# EAGLE design T STorM32 motor v25E (EAGLE 7.5.0)
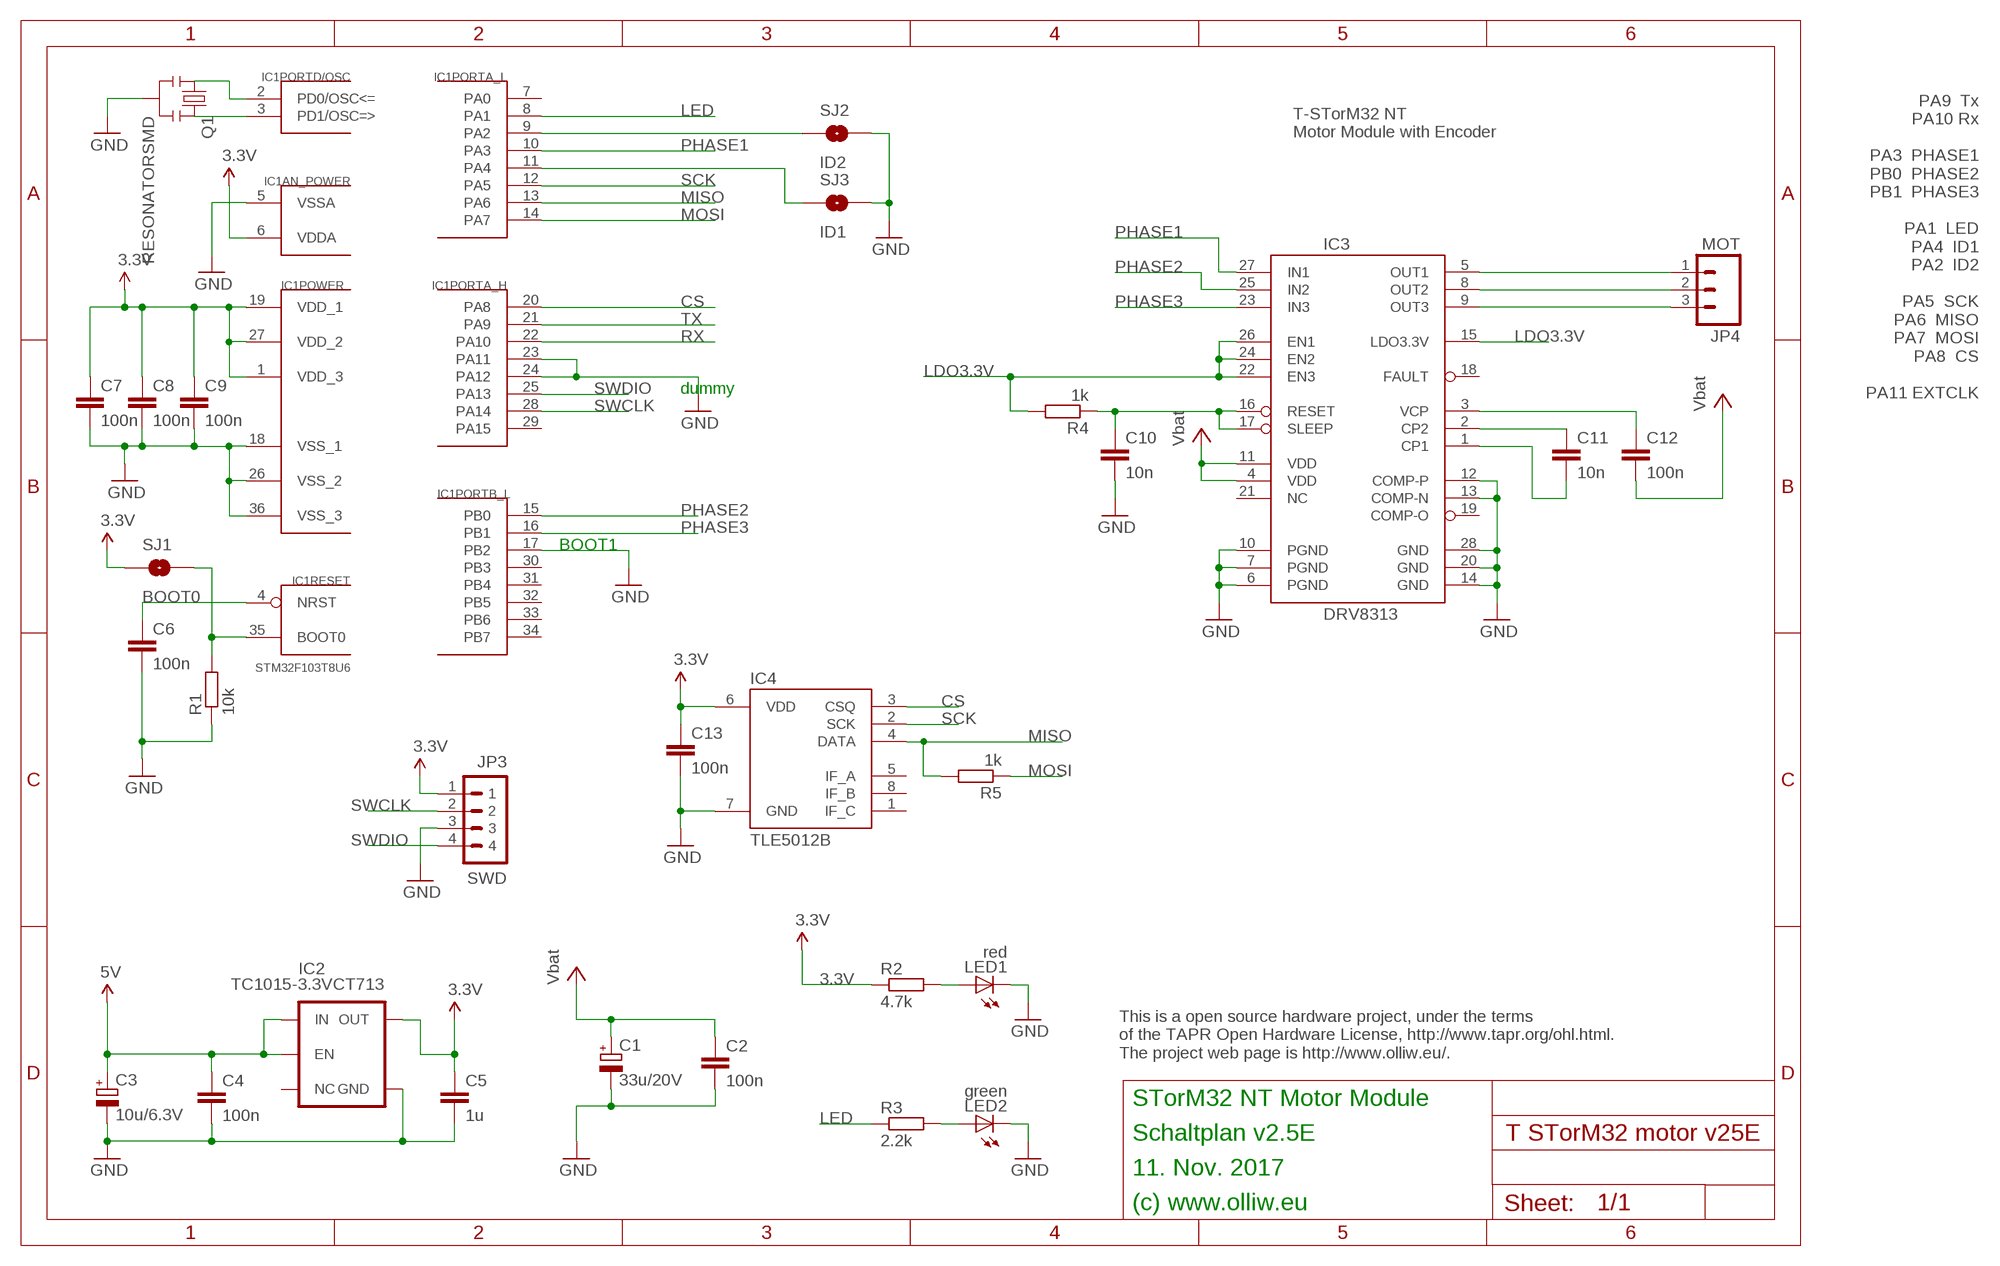
[diagram p0: schematic, sheet 1]

## Parts
C1  33u/20V  CPOL-EUSMCC  [SMC_C]
C2  100n  C-EUC0603  [C0603]
C3  10u/6.3V  CPOL-EUSMCB  [SMC_B]
C4  100n  C-EUC0603  [C0603]
C5  1u  C-EUC0603  [C0603]
C6  100n  C-EUC0603  [C0603]
C7  100n  C-EUC0603  [C0603]
C8  100n  C-EUC0603  [C0603]
C9  100n  C-EUC0603  [C0603]
C10  10n  C-EUC0603  [C0603]
C11  10n  C-EUC0603  [C0603]
C12  100n  C-EUC0603  [C0603]
C13  100n  C-EUC0603  [C0603]
IC1  STM32F103T8U6  STM32F10XTXU6  [VFQFPN36]
IC2  TC1015-3.3VCT713  V_REG_TPS76433SOT23-5  [SOT23-5]
IC3  DRV8313  [HTSSOP28]
IC4  TLE5012B  [SO08]
JP3  SWD  P4X1_1P27-OCT_BILEX  [4X1_1P27_OCT_BILEX]
JP4  MOT  M031X03_NO_SILK  [1X03_NO_SILK]
LED1  red  LEDCHIPLED_0603  [CHIPLED_0603]
LED2  green  LEDCHIPLED_0603  [CHIPLED_0603]
Q1  RESONATORSMD  [RESONATOR-SMD]
R1  10k  R-EU_R0603  [R0603]
R2  4.7k  R-EU_R0603  [R0603]
R3  2.2k  R-EU_R0603  [R0603]
R4  1k  R-EU_R0603  [R0603]
R5  1k  R-EU_R0603  [R0603]
SJ1  BOOT0  SOLDERJUMPERNO  [SJ_2S-NO]
SJ2  ID2  SOLDERJUMPERNO  [SJ_2S-NO]
SJ3  ID1  SOLDERJUMPERNO  [SJ_2S-NO]

## Nets
3.3V: C5.1 C7.1 C8.1 C9.1 C13.1 IC1.1(POWER:VDD_3) IC1.6(AN_POWER:VDDA) IC1.19(POWER:VDD_1) IC1.27(POWER:VDD_2) IC2.5(OUT) IC4.6(VDD) JP3.1 R2.1 SJ1.1
5V: C3.+ C4.1 IC2.1(IN) IC2.3(EN)
CS: IC1.20(PORTA_H:PA8) IC4.3(CSQ)
GND: C1.- C2.2 C3.- C4.2 C5.2 C6.2 C7.2 C8.2 C9.2 C10.2 C13.2 IC1.5(AN_POWER:VSSA) IC1.17(PORTB_L:PB2) IC1.18(POWER:VSS_1) IC1.23(PORTA_H:PA11) IC1.24(PORTA_H:PA12) IC1.26(POWER:VSS_2) IC1.36(POWER:VSS_3) IC2.2(GND) IC3.6(PGND) IC3.7(PGND) IC3.10(PGND) IC3.12(COMP-P) IC3.13(COMP-N) IC3.14(GND) IC3.20(GND) IC3.28(GND) IC4.7(GND) JP3.3 LED1.C LED2.C Q1.2 R1.1 SJ2.2 SJ3.2
LDO3.3V: IC3.15(LDO3.3V) IC3.22(EN3) IC3.24(EN2) IC3.26(EN1) R4.2
LED: IC1.8(PORTA_L:PA1) R3.1
M1: IC3.5(OUT1) JP4.1
M2: IC3.8(OUT2) JP4.2
M3: IC3.9(OUT3) JP4.3
MISO: IC1.13(PORTA_L:PA6) IC4.4(DATA) R5.2
MOSI: IC1.14(PORTA_L:PA7) R5.1
N$3: IC1.9(PORTA_L:PA2) SJ2.1
N$4: IC1.11(PORTA_L:PA4) SJ3.1
N$7: C6.1 IC1.4(RESET:NRST)
N$8: IC1.35(RESET:BOOT0) R1.2 SJ1.2
N$9: IC1.2(PORTD/OSC:PD0/OSC<=) Q1.1
N$10: IC1.3(PORTD/OSC:PD1/OSC=>) Q1.3
N$11: LED1.A R2.2
N$12: LED2.A R3.2
N$16: C11.1 IC3.2(CP2)
N$18: C11.2 IC3.1(CP1)
N$19: C10.1 IC3.16(RESET) IC3.17(SLEEP) R4.1
N$20: C12.1 IC3.3(VCP)
PHASE1: IC1.10(PORTA_L:PA3) IC3.27(IN1)
PHASE2: IC1.15(PORTB_L:PB0) IC3.25(IN2)
PHASE3: IC1.16(PORTB_L:PB1) IC3.23(IN3)
RX: IC1.22(PORTA_H:PA10)
SCK: IC1.12(PORTA_L:PA5) IC4.2(SCK)
SWCLK: IC1.28(PORTA_H:PA14) JP3.2
SWDIO: IC1.25(PORTA_H:PA13) JP3.4
TX: IC1.21(PORTA_H:PA9)
VBAT: C1.+ C2.1 C12.2 IC3.4(VDD) IC3.11(VDD) ; supply symbol labelled Vbat
Unconnected: IC1.7(PORTA_L:PA0) IC1.29(PORTA_H:PA15) IC1.30(PORTB_L:PB3) IC1.31(PORTB_L:PB4) IC1.32(PORTB_L:PB5) IC1.33(PORTB_L:PB6) IC1.34(PORTB_L:PB7) IC2.4(NC) IC3.18(FAULT) IC3.19(COMP-O) IC3.21(NC) IC4.1(IF_C) IC4.5(IF_A) IC4.8(IF_B)

## Notes on the sheet
- PA9  Tx
  PA10 Rx
  
  PA3  PHASE1
  PB0  PHASE2
  PB1  PHASE3
  
  PA1  LED
  PA4  ID1
  PA2  ID2
  
  PA5  SCK
  PA6  MISO
  PA7  MOSI
  PA8  CS
  
  PA11 EXTCLK
- T-STorM32 NT
  Motor Module with Encoder
- dummy
- BOOT1
- This is a open source hardware project, under the terms
  of the TAPR Open Hardware License, http://www.tapr.org/ohl.html.
  The project web page is http://www.olliw.eu/.
- STorM32 NT Motor Module
- Schaltplan v2.5E
- 11. Nov. 2017
- (c) www.olliw.eu

## Library data of the parts
C1 C3 = rcl:CPOL-EU: POLARIZED CAPACITOR, European symbol
C2 C4-C13 = rcl:C-EU: CAPACITOR, European symbol
IC1 = # stm32:STM32F10XTXU6: STM32F101/103 36pad VFQPFN36
IC2 = # SparkFun2:V_REG_TPS76433: Voltage Regulator Older TI part. LDO 150mA regulator. No output by-pass cap option. See V_REG_LDO for a better part.
IC3 = # stdlib:DRV8313
IC4 = # stdlib:TLE5012B
JP3 = # stdlib:P4X1_1P27
JP4 = # SparkFun2:M03: Header 3 Standard 3-pin 0.1" header. Use with straight break away headers (SKU : PRT-00116), right angle break away headers (PRT-00553), swiss pins (PRT-00743), machine pins (PRT-00117), and female headers (PRT-00115). Molex polarized connector foot print use with SKU : PRT-08232 with associated crimp pins and housings.
LED1 LED2 = led:LED: LED OSRAM: - CHIPLED LG R971, LG N971, LY N971, LG Q971, LY Q971, LO R971, LY R971 LH N974, LH R974 LS Q976, LO Q976, LY Q976 LO Q996 - Hyper CHIPLED LW Q18S LB Q993, LB Q99A, LB R99A - SideLED LS A670, LO A670, LY A670, LG A670, LP A670 LB A673, LV A673, LT A673, LW A673 LH A674 LY A675 LS A676, LA A676, LO A676, LY A676, LW A676 LS A679, LY A679, LG A679 - Hyper Micro SIDELED® LS Y876, LA Y876, LO Y876, LY Y876 LT Y87S - SmartLED LW L88C, LW L88S LB L89C, LB L89S, LG L890 LS L89K, LO L89K, LY L89K LS L896, LA L896, LO L896, LY L896 - TOPLED LS T670, LO T670, LY T670, LG T670, LP T670 LSG T670, LSP T670, LSY T670, LOP T670, LYG T670 LG T671, LOG T671, LSG T671 LB T673, LV T673, LT T673, LW T673 LH T674 LS T676, LA T676, LO T676, LY T676, LB T676, LH T676, LSB T676, LW T676 LB T67C, LV T67C, LT T67C, LS T67K, LO T67K, LY T67K, LW E67C LS E67B, LA E67B, LO E67B, LY E67B, LB E67C, LV E67C, LT E67C LW T67C LS T679, LY T679, LG T679 LS T770, LO T770, LY T770, LG T770, LP T770 LB T773, LV T773, LT T773, LW T773 LH T774 LS E675, LA E675, LY E675, LS T675 LS T776, LA T776, LO T776, LY T776, LB T776 LHGB T686 LT T68C, LB T68C - Hyper Mini TOPLED® LB M676 - Mini TOPLED Santana® LG M470 LS M47K, LO M47K, LY M47K Source: http://www.osram.convergy.de LUXEON: - LUMILED® LXK2-PW12-R00, LXK2-PW12-S00, LXK2-PW14-U00, LXK2-PW14-V00 LXK2-PM12-R00, LXK2-PM12-S00, LXK2-PM14-U00 LXK2-PE12-Q00, LXK2-PE12-R00, LXK2-PE12-S00, LXK2-PE14-T00, LXK2-PE14-U00 LXK2-PB12-K00, LXK2-PB12-L00, LXK2-PB12-M00, LXK2-PB14-N00, LXK2-PB14-P00, LXK2-PB14-Q00 LXK2-PR12-L00, LXK2-PR12-M00, LXK2-PR14-Q00, LXK2-PR14-R00 LXK2-PD12-Q00, LXK2-PD12-R00, LXK2-PD12-S00 LXK2-PH12-R00, LXK2-PH12-S00 LXK2-PL12-P00, LXK2-PL12-Q00, LXK2-PL12-R00 Source: www.luxeon.com KINGBRIGHT: KA-3528ASYC Source: www.kingbright.com
Q1 = # SparkFun2:RESONATOR: Resonator Small SMD resonator. This is the itty bitty 10/20MHz resonators with built in caps. CSTCE10M0G55 and CSTCE20M0V53. Footprint has been reviewed closely but hasn't been tested yet.
R1-R5 = rcl:R-EU_: RESISTOR, European symbol
SJ1-SJ3 = # SparkFun2:SOLDERJUMPER: Solder Jumper Standard SMD solder jumper. Used to automate production. Two varients : Normally Open and Normally Closed are the same, but have different paste layers. NC will have a large amount of paste and should jumper during reflow.

## Board
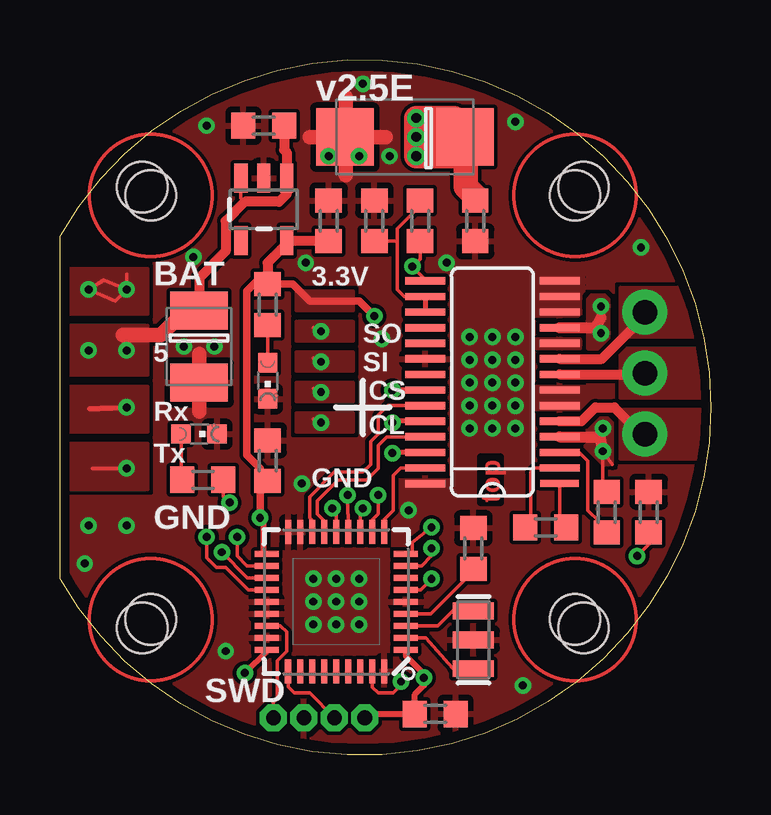
[diagram p1: board, top side]
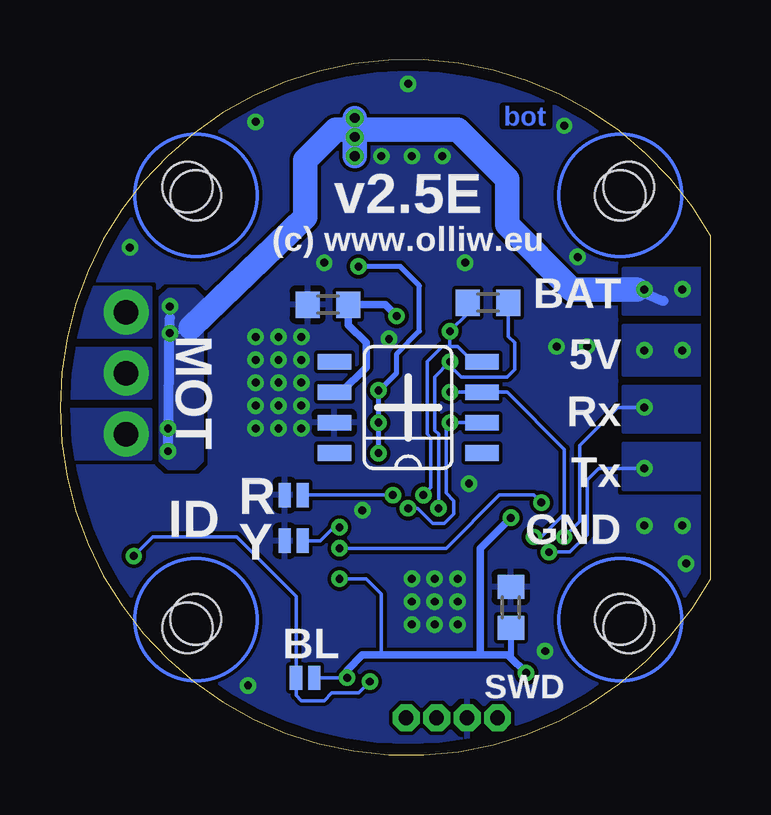
[diagram p2: board, bottom side, seen from below]

Size 27.12 x 28.97 mm. Coordinates in mm from the lower left corner, seen from the top.
Outline: 0,7.34 0,21.63 arc-301 0,7.34
Copper layers (1*16): Top 0.0356mm / dielectric 1.5011mm / Bottom 0.0356mm
Design rules "ow-oshpark-2layer": minimum track width 6mil, minimum drill 13mil, track to track 6mil, track to pad 6mil, pad to pad 6mil, via to via 6mil, smd to smd 6mil, copper to edge 15mil, drill to drill 6mil, minimum pad ring 7mil, minimum via ring 7mil, stop-mask expansion 2.5mil, vias tented up to drill 26mil, thermal gap 10mil
Holes 2.1 mm at 3.78,23.33 21.46,23.33 21.46,5.65 3.78,5.65 3.43,23.68 21.81,23.68 21.81,5.3 3.43,5.3

### Footprints (pad centres in the part's own frame; a part is rotated, then mirrored left to right if it is on the bottom)
SMC_C = smd 2.4 x 2.4: + -2.5,0; - 2.5,0
C0603 = smd 1 x 1.1: 1 -0.85,0; 2 0.85,0
SMC_B = smd 1.6 x 2.4: + -1.5,0; - 1.5,0
VFQFPN36 = smd 1 x 0.25: 1 -2.9,2; 2 -2.9,1.5; 3 -2.9,1; 4 -2.9,0.5; 5 -2.9,0; 6 -2.9,-0.5; 7 -2.9,-1; 8 -2.9,-1.5; 9 -2.9,-2; 19 2.9,-2; 20 2.9,-1.5; 21 2.9,-1; 22 2.9,-0.5; 23 2.9,0; 24 2.9,0.5; 25 2.9,1; 26 2.9,1.5; 27 2.9,2 | smd 0.25 x 1: 10 -2,-2.9; 11 -1.5,-2.9; 12 -1,-2.9; 13 -0.5,-2.9; 14 0,-2.9; 15 0.5,-2.9; 16 1,-2.9; 17 1.5,-2.9; 18 2,-2.9; 29 1.5,2.9; 30 1,2.9; 31 0.5,2.9; 32 0,2.9; 33 -0.5,2.9; 34 -1,2.9; 35 -1.5,2.9; 36 -2,2.9 | smd 0.27 x 1: 28 2,2.9
SOT23-5 = smd 0.55 x 1.2: 1 -0.95,-1.3; 2 0,-1.3; 3 0.95,-1.3; 4 0.95,1.3; 5 -0.95,1.3
HTSSOP28 = smd 0.3 x 1.6: 1 0,-2.8 | smd 0.305 x 1.676: 2 0.65,-2.8; 3 1.3,-2.8; 4 1.95,-2.8; 5 2.6,-2.8; 6 3.25,-2.8; 7 3.9,-2.8; 8 4.55,-2.8; 9 5.2,-2.8; 10 5.85,-2.8; 11 6.5,-2.8; 12 7.15,-2.8; 13 7.8,-2.8; 14 8.45,-2.8; 15 8.45,2.8; 16 7.8,2.8; 17 7.15,2.8; 18 6.5,2.8; 19 5.85,2.8; 20 5.2,2.8; 21 4.55,2.8; 22 3.9,2.8; 23 3.25,2.8; 24 2.6,2.8; 25 1.95,2.8; 26 1.3,2.8; 27 0.65,2.8; 28 0,2.8
SO08 = smd 0.66 x 1.397: 1 0,-3.073; 2 1.27,-3.073; 3 2.54,-3.073; 4 3.81,-3.073; 5 3.81,3.073; 6 2.54,3.073; 7 1.27,3.073; 8 0,3.073
4X1_1P27_OCT_BILEX = drill 0.61 pad 1.118 octagon: 1 0,0; 2 0,-1.27; 3 0,-2.54; 4 0,-3.81
1X03_NO_SILK = drill 1.016 pad 1.88: 1 0,0; 2 2.54,0; 3 5.08,0
CHIPLED_0603 = smd 0.8 x 0.8: A 0,-0.75; C 0,0.75
RESONATOR-SMD = smd 0.7 x 1.7: 1 -1.2,0; 2 0,0; 3 1.2,0
R0603 = smd 1 x 1.1: 1 -0.85,0; 2 0.85,0
SJ_2S-NO = smd 0.508 x 1.016: 1 -0.381,0; 2 0.381,0

### Placement (x,y rotation side)
C1  14.37,25.76 180 top
C2  17.3,22.27 270 top
C3  5.79,17.03 270 top
C4  8.49,26.23 180 top
C5  11.19,22.27 90 top
C6  17.22,8.61 90 top
C7  8.33,6.15 90 bottom
C8  8.65,12.26 90 top
C9  15.64,1.71 0 top
C10  13.1,22.27 90 top
C11  20.24,9.49 0 top
C12  22.78,10.12 90 top
C13  15.95,18.77 180 bottom
IC1  11.51,6.39 180 top
IC2  8.49,22.74 180 top
IC3  18.02,11.31 90 top
IC4  12.62,12.58 90 bottom
JP3  12.7,1.55 270 top
JP4  24.37,13.38 90 top
LED1  8.65,15.6 180 top
LED2  5.79,13.38 270 top
Q1  17.22,4.8 90 top
R1  24.53,10.12 270 top
R2  8.65,18.77 270 top
R3  5.95,11.47 180 top
R4  15,22.27 270 top
R5  9.29,18.85 180 bottom
SJ1  16.91,3.22 180 bottom
SJ2  17.38,8.93 180 bottom
SJ3  17.38,10.84 180 bottom

### Tracks (layer width: path | path; a pad name or v marks a point on that pad's centre or on a via)
3.3V  (via drill 0.33)
  Top 0.152: IC1.19 8.49,8.39 | IC1.6 15.03,6.89 v15.48,7.34 | 8.6,19.73 R2.1 | 9.39,21.26 9.39,21.55 IC2.5 9.63,21.42 | 8.33,11.1 C8.1 8.65,11.47 8.33,11.47
  Top 0.254: IC1.27 8.61,4.32 v7.7,3.41 | 8.49,8.39 8.49,9.72 v8.33,9.88 | IC1.1 14.41,4.13 15.16,3.38 v15.16,3.22 15.16,2.9 14.79,2.52 C9.1 13.1,1.71 12.86,1.47 JP3.1
  Top 0.305: v13.1,18.3 12.46,18.93 10.4,18.93 9.71,19.62 R2.1 | 8.6,19.73 8.18,19.73 7.78,19.33 7.78,12.5 8.33,11.95 8.33,11.47 | v8.33,9.88 8.33,11.1
  Top 0.406: 9.39,21.26 8.65,20.52 R2.1 | C5.1 9.63,21.42
  Bottom 0.152: IC4.6 15.4,15.12 | v15.48,7.34 14.37,7.34 13.73,6.71 13.73,4.17 | SJ1.1 v15.16,3.22
  Bottom 0.254: C7.1 8.33,4.17 8.39,4.11
  Bottom 0.305: v8.33,9.88 9.6,8.61 9.6,4.17 | 15.4,15.12 14.37,16.15 14.37,17.19 15.1,17.92 C13.1 13.57,18.77 v13.1,18.3 | 9.6,4.17 8.45,4.17 8.39,4.11 v7.7,3.41 | 9.6,4.17 13.73,4.17 14.53,4.17 15.16,3.53 v15.16,3.22
  pour Top: 9.84,19.33 12.22,19.33 12.22,18.54 9.84,18.54
5V  (via drill 0.33)
  Top 0.152: 2.85,17.58 v2.78,16.87 2.62,17.5 | 7.7,23.06 7.54,23.22 IC2.3 | 9.45,23.54 9.44,23.54
  Top 0.406: C3.+ 5.41,18.69 5.79,18.77 5.79,19.88 6.91,21 6.91,22.27 7.7,23.06 9.13,23.06 9.44,23.38 9.44,23.54 IC2.1 | C4.1 9.34,25.23 9.45,25.12 9.45,23.54
  Top 0.61: C3.+ 5,18.3 4.21,17.5 2.62,17.5
  other vias: 1.19,16.87
  pour Top: 0.32,17.9 3.65,17.9 3.65,15.84 0.32,15.84
  pour Bottom: 0.32,17.9 3.65,17.9 3.65,15.84 0.32,15.84
CS  (via drill 0.33)
  Top 0.152: v7.38,9.09 7.38,8.3 7.79,7.89 IC1.20 | v10.87,15.12 10.56,15.28
  Bottom 0.152: v10.87,15.12 IC4.3 8.49,15.12 6.11,12.74 6.11,10.04 7.06,9.09 v7.38,9.09
  pour Top: 9.84,15.52 12.22,15.52 12.22,14.73 9.84,14.73
GND  (via drill 0.33)
  Top 0.61: 5.79,14.33 5.79,16.71 | 11.91,24.17 11.91,27.43 | 13.57,25.76 10.4,25.76
  other vias: 12.46,5.44 10.56,6.39 17.07,15.52 17.07,14.57 11.51,6.39 10.56,7.34 11.51,7.34 12.46,7.34 12.46,6.39 10.56,5.44 11.51,5.44 17.07,16.47 18.02,17.42 18.02,16.47 18.02,15.52 18.02,14.57 18.02,13.61 18.97,17.42 18.97,16.47 18.97,15.52 18.97,14.57 18.97,13.61 17.07,17.42 2.78,9.57 1.19,9.57 17.07,13.61 5.56,20.76 6.11,26.23 12.62,27.98 18.97,26.39 24.21,21.15 1.03,7.98 6.91,4.33 19.29,2.9 10.08,11.31 10.24,20.52 13.41,17.34 14.53,10.2 5.16,17.03 6.43,17.03 11.19,24.96 12.46,24.96 13.73,24.96 16.11,20.52
  pour Top (isolate 0.152, rank 6): 12.62,28.46 arc90 -1.35,14.49 arc90 12.62,0.52 arc90 26.59,14.49 arc90
  pour Bottom (isolate 0.152, rank 6): 12.62,28.46 arc-90 26.59,14.49 arc-90 12.62,0.52 arc-90 -1.35,14.49 arc-90
  pour Top (no thermals): 21.67,18.38 21.59,18.3 19.45,18.3 19.45,20.2 21.83,20.2 21.83,19.33 21.67,19.17
  pour Top (no thermals): 21.99,14.41 19.45,14.41 19.45,15.36 21.99,15.36
  pour Top (no thermals): 21.67,16.95 19.61,16.95 19.61,17.34 21.67,17.34
  pour Top (no thermals): 16.43,10.92 14.05,10.92 14.05,11.47 16.43,11.47
LDO3.3V  (via drill 0.33)
  Top 0.152: 13.88,12.61 v13.85,12.58 | IC3.15 15.22,19.83 v14.68,20.36 15,20.68 R4.2
  Top 0.203: IC3.24 13.95,13.91 v13.85,13.85 | IC3.22 13.92,15.21 v13.85,15.2 | IC3.26 13.88,12.61
  Bottom 0.152: v13.85,15.2 13.81,15.2
  Bottom 0.203: v13.85,12.58 v13.85,13.85 v13.85,15.2 | 13.81,15.2 13.1,15.92 13.1,16.71 12.14,17.66 12.14,19.57 12.94,20.36 v14.68,20.36
LED  (via drill 0.33)
  Top 0.152: IC1.8 15.07,7.89 15.48,8.3 v15.48,8.61 | v7.06,10.52 6.8,10.78 R3.1
  Bottom 0.152: v15.48,8.61 11.03,8.61 8.81,10.84 7.38,10.84 v7.06,10.52
M1
  Top 0.406: IC3.5 21.73,13.91 22.3,14.49 23.1,14.49 24.21,13.38 JP4.1
  pour Top (no thermals): 23.34,14.41 26.67,14.41 26.67,12.34 23.34,12.34
  pour Bottom (no thermals): 23.34,14.41 26.67,14.41 26.67,12.34 23.34,12.34
M2
  Top 0.406: IC3.8 24.31,15.86 JP4.2
  pour Top (no thermals): 23.34,16.95 26.67,16.95 26.67,14.88 23.34,14.88
  pour Bottom (no thermals): 23.34,16.95 26.67,16.95 26.67,14.88 23.34,14.88
M3
  Top 0.406: IC3.9 22.58,16.51 24.37,18.3 JP4.3
  pour Top (no thermals): 23.34,19.49 26.67,19.49 26.67,17.42 23.34,17.42
  pour Bottom (no thermals): 23.34,19.49 26.67,19.49 26.67,17.42 23.34,17.42
MISO  (via drill 0.33)
  Top 0.152: v10.87,17.66 10.56,17.82 | IC1.13 12.01,10.02 11.99,10.04 v11.99,10.84
  Bottom 0.152: IC4.4 9.92,16.39 10.56,17.03 10.87,17.03 | v11.99,10.84 11.67,11.15 11.67,13.22 11.83,13.38 11.83,16.39 11.19,17.03 10.87,17.03 | R5.2 10.14,18.4 v10.87,17.66 10.87,17.03
  pour Top: 9.84,18.06 12.22,18.06 12.22,17.27 9.84,17.27
MOSI  (via drill 0.33)
  Top 0.152: v10.87,16.39 10.56,16.55 | IC1.14 11.51,10.12 v11.35,10.28
  Bottom 0.152: v11.35,10.28 11.35,13.38 11.51,13.53 11.51,15.76 v10.87,16.39 10.87,16.23 10.4,15.76 8.49,15.76 8.18,16.08 8.18,17.19 8.44,17.45 R5.1
  pour Top: 9.84,16.79 12.22,16.79 12.22,16 9.84,16
N$3  (via drill 0.33)
  Top 0.152: IC1.9 14.46,8.39 14.68,8.45 14.68,8.85 v15.48,9.49
  Bottom 0.152: v15.48,9.49 15.72,9.49 16.27,8.93 SJ2.1
N$4  (via drill 0.33)
  Top 0.152: IC1.11 13.01,9.8 13.26,10.04 v13.26,10.84
  Bottom 0.152: v13.26,10.84 SJ3.1
N$7
  Top 0.152: IC1.4 15.45,5.89 17.07,7.5 C6.1
N$8  (via drill 0.33)
  Top 0.152: IC1.35 13.01,2.83 13.26,2.58 13.89,2.58 14.21,2.9 v14.21,3.06 | v24.05,8.3 24.53,8.77 R1.2
  Bottom 0.152: v14.21,3.06 14.68,2.58 15.8,2.58 16.11,2.26 17.07,2.26 17.29,2.49 SJ1.2 17.29,6.61 19.76,9.09 23.26,9.09 v24.05,8.3
N$9
  Top 0.152: IC1.2 15.23,4.89 16.36,3.6 Q1.1
N$10
  Top 0.152: IC1.3 15.75,5.39 16.36,6 Q1.3
N$11
  Top 0.152: R2.2 LED1.A
N$12
  Top 0.152: LED2.A 5.04,11.73 R3.2
N$16
  Top 0.152: IC3.2 19.78,11.96 19.61,11.79 19.61,9.62 C11.1
N$18
  Top 0.152: IC3.1 20.82,9.68 C11.2
N$19
  Top 0.152: IC3.16 14.35,19.11 14.05,19.41 14.05,21.47 | 14.05,21.47 14.05,21.95 15,22.9 14.95,23.06 R4.1 | C10.1 13.99,21.42 14.05,21.47
  Top 0.203: IC3.16 IC3.17
N$20
  Top 0.152: IC3.3 21.64,12.61 21.99,12.27 21.99,10.2 22.46,9.72 23.04,9.41 C12.1
PHASE1
  Top 0.152: IC3.27 14.21,11.96 13.89,11.65 13.89,10.2 13.51,9.82 IC1.10
PHASE2
  Top 0.152: IC3.25 13.62,13.26 13.26,12.9 13.26,11.95 12.78,11.47 11.59,11.47 10.72,10.6 10.72,10.04 11.01,9.75 IC1.15
PHASE3
  Top 0.152: IC3.23 13.65,14.56 13.26,14.17 13.26,13.38 12.94,13.06 12.94,12.11 12.62,11.79 11.43,11.79 10.4,10.76 10.4,9.88 10.51,9.77 IC1.16
RX  (via drill 0.33)
  Top 0.152: IC1.22 7.83,6.89 6.91,7.82 6.51,7.82 6.11,8.22 v6.11,9.09 | v2.78,14.49 1.72,14.49 1.68,14.45
  Top 0.203: 1.24,14.44 1.68,14.45 v2.78,14.49
  Bottom 0.152: v6.11,9.09 5.48,9.72 5.48,12.9 3.89,14.49 v2.78,14.49
  pour Top: 0.32,15.36 3.65,15.36 3.65,13.46 0.32,13.46
  pour Bottom: 0.32,15.36 3.65,15.36 3.65,13.46 0.32,13.46
SCK  (via drill 0.33)
  Top 0.152: v10.87,13.85 10.56,14.01 | IC1.12 12.51,10.17 v12.62,10.28
  Bottom 0.152: IC4.2 v10.87,13.85 11.03,13.69 11.03,10.92 10.72,10.6 10.72,10.04 11.11,9.65 11.59,9.65 12.22,10.28 v12.62,10.28
  pour Top: 9.84,14.25 12.22,14.25 12.22,13.46 9.84,13.46
SWCLK
  Top 0.152: IC1.28 9.51,2.83 9.76,2.58 10.4,2.58 JP3.2
SWDIO
  Top 0.152: JP3.4 8.89,2.18 9.05,2.34 9.05,3.93 9.45,4.33 9.45,5.12 9.18,5.39 IC1.25
TX  (via drill 0.33)
  Top 0.152: IC1.21 7.81,7.39 v6.75,8.45 | v2.78,11.95 1.35,11.95
  Bottom 0.152: v6.75,8.45 5.87,8.45 5.16,9.17 5.16,11.47 4.68,11.95 v2.78,11.95
  pour Top: 0.32,12.98 3.65,12.98 3.65,11.07 0.32,11.07
  pour Bottom: 0.32,12.98 3.65,12.98 3.65,11.07 0.32,11.07
VBAT  (via drill 0.33, 0.4)
  Top 0.152: 23.02,12.11 v22.62,12.66 | 22.38,12.74 v22.62,12.66 | C12.2 22.88,11.05 22.62,11.31 v22.62,12.66 | v2.78,19.41 2.3,18.93 v1.19,19.41 1.83,19.81 v2.78,19.41 | v2.78,19.41 2.78,20.04 | 16.43,26.55 17.54,26.08 17.18,26.08 C1.+ | 16.75,24.97 16.59,24.97 16.11,25.76 | C2.1 17.3,23.3 | 16.91,25.92 16.27,26.55
  Top 0.457: IC3.11 22.3,17.81 22.54,18.22 | IC3.4 22.5,13.26 v22.62,12.66
  Top 1.016: 16.43,26.55 16.27,26.55 v14.84,26.55 v14.84,25.76 | v14.84,25.76 v14.84,24.97 16.59,24.97 | 16.11,25.76 v14.84,25.76 | 17.3,23.3 16.91,23.7 16.91,25.92
  Bottom 0.152: 3.1,19.41 v2.78,19.41 | 21.67,17.82 22.46,17.5 v22.54,17.58
  Bottom 0.406: v22.62,12.66 22.54,18.22 | 3.1,19.41 1.98,18.93
  Bottom 1.016: 3.1,19.41 5.79,19.41 8.49,22.11 8.49,24.01 10.56,26.08 14.84,26.08 | 21.67,17.82 16.91,22.42 16.91,24.81 15.64,26.08 14.84,26.08 | v14.84,24.97 v14.84,25.76 14.84,26.08 | 14.84,26.08 v14.84,26.55
  other vias: 22.54,18.69 22.62,13.61
  pour Bottom: 21.19,19.09 21.19,12.26 21.51,11.95 22.62,11.95 22.94,12.26 22.94,19.09 22.62,19.41 21.51,19.41
  pour Top: 21.51,13.53 21.99,13.53 22.54,14.09 22.78,14.09 23.02,13.85 23.02,12.11 22.62,12.11 21.75,12.98 21.51,12.98
  pour Top: 21.51,17.98 21.51,17.74 21.83,17.74 21.99,17.58 21.99,16.95 22.07,16.87 22.38,16.87 22.86,17.34 22.86,19.01 22.7,19.17 22.15,19.17 21.99,19.01 21.99,18.14 21.83,17.98
  pour Top: 3.65,20.28 3.65,18.38 0.32,18.38 0.32,20.28
  pour Bottom: 0.32,20.28 3.65,20.28 3.65,18.38 0.32,18.38
(copper drawn outside any net)
  shapes: Bottom circle x4, Top circle x4

### Text on the board
Top: top
Bottom: bot
tNames: v2.5E | BAT | 3.3V | SO | 5 | SI | CS | Rx | CL | Tx | GND | GND | SWD
bNames: v2.5E | (c) www.olliw.eu | BAT | 5V | MOT | Rx | Tx | GND | R | ID | Y | BL | SWD